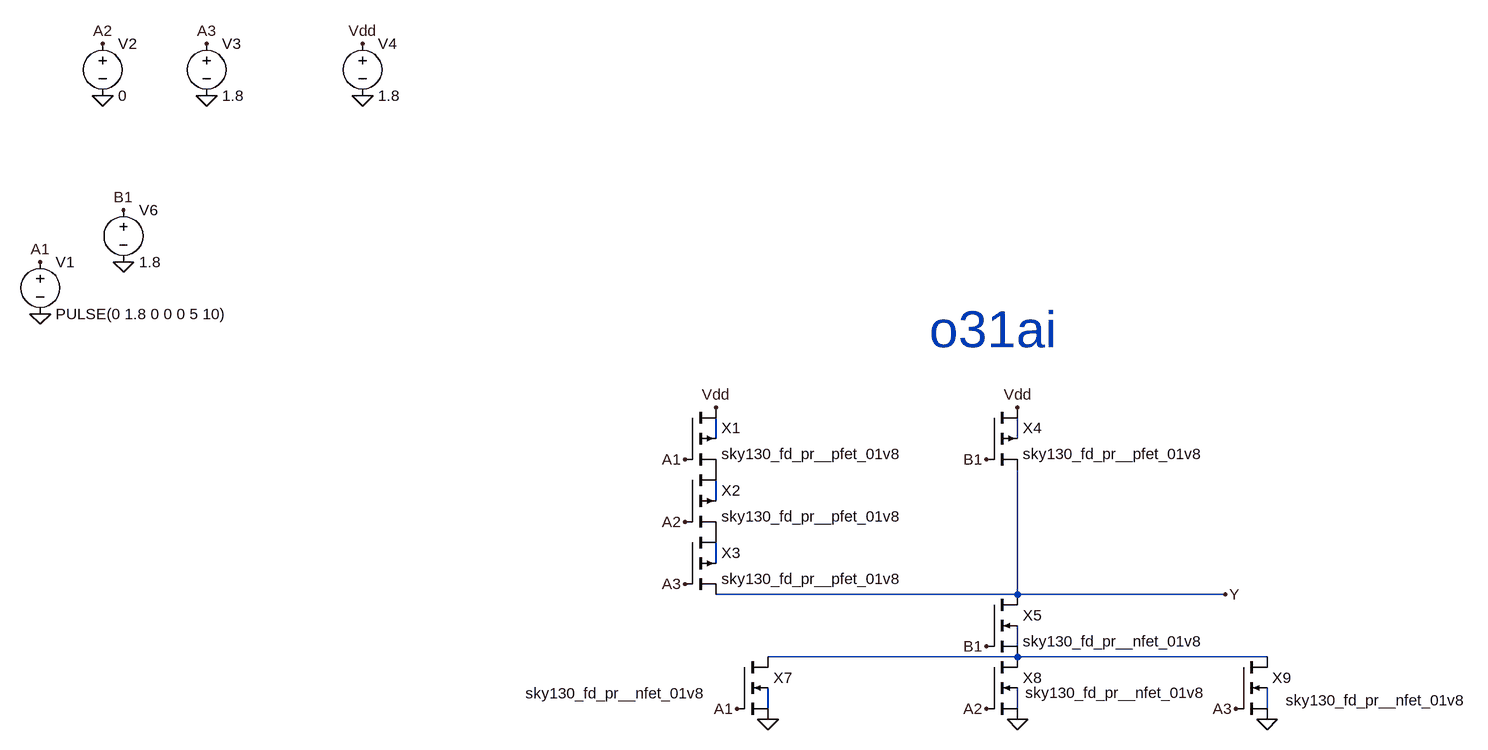
[diagram p0: schematic o31ai.asc]
o31ai.asc, the LTspice schematic file:
Version 4
SHEET 1 900 680
WIRE -288 32 -288 0
WIRE 176 32 176 0
WIRE -288 128 -288 96
WIRE -288 224 -288 192
WIRE 176 272 176 80
WIRE 176 272 -288 272
WIRE 496 272 176 272
WIRE 176 352 176 320
WIRE 176 368 -208 368
WIRE 560 368 176 368
WIRE -208 448 -208 416
WIRE 176 448 176 416
WIRE 560 448 560 416
FLAG -288 -16 Vdd
FLAG -1328 -160 0
FLAG -1232 -496 0
FLAG -1072 -496 0
FLAG -1328 -240 A1
FLAG -1232 -576 A2
FLAG -1072 -576 A3
FLAG -832 -576 Vdd
FLAG -832 -496 0
FLAG -1200 -240 0
FLAG -1200 -320 B1
FLAG -336 64 A1
FLAG -336 160 A2
FLAG -336 256 A3
FLAG 128 352 B1
FLAG -208 464 0
FLAG 176 464 0
FLAG 560 464 0
FLAG -256 448 A1
FLAG 128 448 A2
FLAG 512 448 A3
FLAG 128 64 B1
FLAG 176 -16 Vdd
FLAG 496 272 Y
SYMBOL pmos4 -336 -16 R0
SYMATTR InstName X1
SYMATTR Value2 l=0.13u w=4u
SYMATTR Value sky130_fd_pr__pfet_01v8
SYMBOL pmos4 -336 80 R0
SYMATTR InstName X2
SYMATTR Value2 l=0.13u w=4u
SYMATTR Value sky130_fd_pr__pfet_01v8
SYMBOL pmos4 -336 176 R0
SYMATTR InstName X3
SYMATTR Value2 l=0.13u w=4u
SYMATTR Value sky130_fd_pr__pfet_01v8
SYMBOL pmos4 128 -16 R0
SYMATTR InstName X4
SYMATTR Value2 l=0.13u w=4u
SYMATTR Value sky130_fd_pr__pfet_01v8
SYMBOL voltage -1328 -256 R0
WINDOW 123 0 0 Left 0
WINDOW 39 0 0 Left 0
SYMATTR InstName V1
SYMATTR Value PULSE(0 1.8 0 0 0 5 10)
SYMBOL voltage -1232 -592 R0
WINDOW 123 0 0 Left 0
WINDOW 39 0 0 Left 0
SYMATTR InstName V2
SYMATTR Value 0
SYMBOL voltage -1072 -592 R0
WINDOW 123 0 0 Left 0
WINDOW 39 0 0 Left 0
SYMATTR InstName V3
SYMATTR Value 1.8
SYMBOL voltage -832 -592 R0
WINDOW 123 0 0 Left 0
WINDOW 39 0 0 Left 0
SYMATTR InstName V4
SYMATTR Value 1.8
SYMBOL voltage -1200 -336 R0
WINDOW 123 0 0 Left 0
WINDOW 39 0 0 Left 0
SYMATTR InstName V6
SYMATTR Value 1.8
SYMBOL nmos4 128 272 R0
SYMATTR InstName X5
SYMATTR Value2 l=0.13u w=2u
SYMATTR Value sky130_fd_pr__nfet_01v8
SYMBOL nmos4 -256 368 R0
WINDOW 3 -325 56 Left 2
SYMATTR InstName X7
SYMATTR Value2 l=0.13u w=2u
SYMATTR Value sky130_fd_pr__nfet_01v8
SYMBOL nmos4 128 368 R0
WINDOW 3 60 55 Left 2
SYMATTR InstName X8
SYMATTR Value2 l=0.13u w=2u
SYMATTR Value sky130_fd_pr__nfet_01v8
SYMBOL nmos4 512 368 R0
WINDOW 3 77 67 Left 2
SYMATTR InstName X9
SYMATTR Value2 l=0.13u w=2u
SYMATTR Value sky130_fd_pr__nfet_01v8
TEXT 40 -136 Left 6 ;o31ai

The netlist it stands for:
* o31ai.asc
M§X1 Vdd A1 P001 N001 sky130_fd_pr__pfet_01v8 l=0.13u w=4u
M§X2 P001 A2 P002 N003 sky130_fd_pr__pfet_01v8 l=0.13u w=4u
M§X3 P002 A3 Y N004 sky130_fd_pr__pfet_01v8 l=0.13u w=4u
M§X4 Vdd B1 Y N002 sky130_fd_pr__pfet_01v8 l=0.13u w=4u
V1 A1 0 PULSE(0 1.8 0 0 0 5 10)
V2 A2 0 0
V3 A3 0 1.8
V4 Vdd 0 1.8
V6 B1 0 1.8
M§X5 Y B1 N006 N005 sky130_fd_pr__nfet_01v8 l=0.13u w=2u
M§X7 N006 A1 0 N007 sky130_fd_pr__nfet_01v8 l=0.13u w=2u
M§X8 N006 A2 0 N008 sky130_fd_pr__nfet_01v8 l=0.13u w=2u
M§X9 N006 A3 0 N009 sky130_fd_pr__nfet_01v8 l=0.13u w=2u
.model NMOS NMOS
.model PMOS PMOS
.lib standard.mos
* o31ai
.backanno
.end